# Altium schematic sheet Supply.SchDoc
size A4
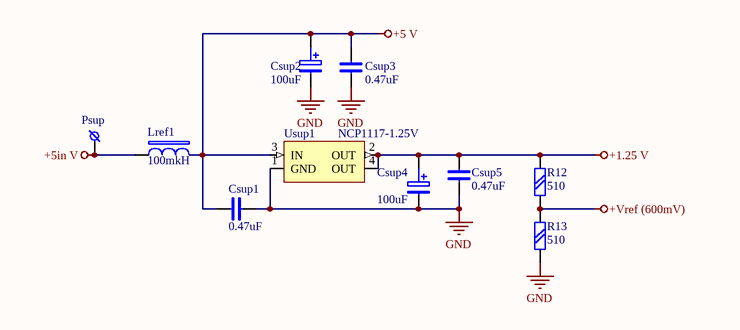
[diagram p0: Supply.SchDoc]

## Parts
Csup1  0.47uF  [chip0805]
Csup2  100uF  [CEL-SMD300]
Csup3  0.47uF  [chip0805]
Csup4  100uF  [CEL-SMD300]
Csup5  0.47uF  [chip0805]
Lref1  100mkH  [SDR0604]
Psup  KLEMME  [Pad12]  (value not drawn)
R12  510  [chip0805]
R13  510  [chip0805]
Usup1  NCP1117-1.25V  [TO-252]

## Nets
+1.25 V: Csup4.+ Csup5.1 R12.2 Usup1.2(OUT) Usup1.4(OUT)
+5 V: Csup1.1 Csup2.+ Csup3.1 Lref1.2 Usup1.3(IN)
+5in V: Lref1.1 Psup.PAD
+Vref (600mV): R12.1 R13.1
GND: Csup1.2 Csup2.- Csup3.2 Csup4.- Csup5.2 R13.2 Usup1.1(GND)

## Library data of the parts
Csup1 Csup3 Csup5 = C: Text Field1: 20; Text Field2: 10
Csup2 Csup4 = C POL: Text Field1: 20; Text Field2: 20
Lref1 = DR: Text Field1: 30; Text Field2: 10
Psup = KLEMME: Text Field1: 10; Text Field2: 20
R12 R13 = R: Text Field1: 20; Text Field2: 20
Usup1 = NCP1117-3.3V